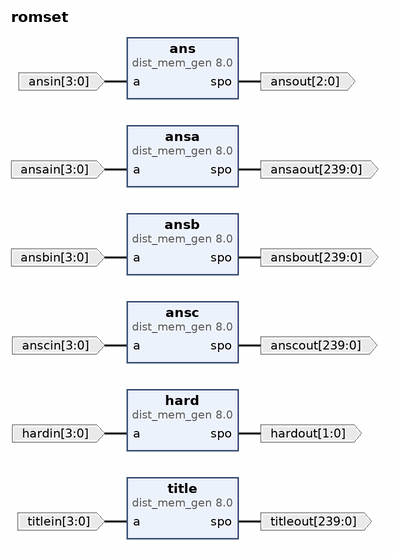
[diagram p0: block diagram of the top level]
# Vivado block design romset, xc7z020clg400-2, Vivado 2018.2
create_bd_design romset

create_bd_port -dir I -from 3 -to 0 ansin
create_bd_port -dir O -from 2 -to 0 ansout
create_bd_port -dir I -from 3 -to 0 ansain
create_bd_port -dir O -from 239 -to 0 ansaout
create_bd_port -dir I -from 3 -to 0 anscin
create_bd_port -dir O -from 239 -to 0 ansbout
create_bd_port -dir I -from 3 -to 0 ansbin
create_bd_port -dir O -from 1 -to 0 hardout
create_bd_port -dir I -from 3 -to 0 titlein
create_bd_port -dir I -from 3 -to 0 hardin
create_bd_port -dir O -from 239 -to 0 anscout
create_bd_port -dir O -from 239 -to 0 titleout

create_bd_cell -type ip -vlnv xilinx.com:ip:dist_mem_gen:8.0 title
set_property -dict [list \
  CONFIG.depth 16 \
  CONFIG.data_width 240 \
  CONFIG.memory_type rom \
  CONFIG.coefficient_file ../../../../xxx/title.coe \
] [get_bd_cells title]
create_bd_cell -type ip -vlnv xilinx.com:ip:dist_mem_gen:8.0 ansa
set_property -dict [list \
  CONFIG.depth 16 \
  CONFIG.data_width 240 \
  CONFIG.memory_type rom \
  CONFIG.coefficient_file ../../../../ansa.coe \
] [get_bd_cells ansa]
create_bd_cell -type ip -vlnv xilinx.com:ip:dist_mem_gen:8.0 ansb
set_property -dict [list \
  CONFIG.depth 16 \
  CONFIG.data_width 240 \
  CONFIG.memory_type rom \
  CONFIG.coefficient_file ../../../../ansb.coe \
] [get_bd_cells ansb]
create_bd_cell -type ip -vlnv xilinx.com:ip:dist_mem_gen:8.0 ansc
set_property -dict [list \
  CONFIG.depth 16 \
  CONFIG.data_width 240 \
  CONFIG.memory_type rom \
  CONFIG.coefficient_file ../../../../ansc.coe \
] [get_bd_cells ansc]
create_bd_cell -type ip -vlnv xilinx.com:ip:dist_mem_gen:8.0 hard
set_property -dict [list \
  CONFIG.depth 16 \
  CONFIG.data_width 2 \
  CONFIG.memory_type rom \
  CONFIG.coefficient_file ../../../../hard.coe \
] [get_bd_cells hard]
create_bd_cell -type ip -vlnv xilinx.com:ip:dist_mem_gen:8.0 ans
set_property -dict [list \
  CONFIG.depth 16 \
  CONFIG.data_width 3 \
  CONFIG.memory_type rom \
  CONFIG.coefficient_file ../../../../ans.coe \
] [get_bd_cells ans]

# ---- connections ----

connect_bd_net -net a_0_1 [get_bd_ports ansin] [get_bd_pins ans/a]
connect_bd_net [get_bd_pins ans/spo] [get_bd_ports ansout]
connect_bd_net -net a_1_1 [get_bd_ports ansain] [get_bd_pins ansa/a]
connect_bd_net [get_bd_pins ansa/spo] [get_bd_ports ansaout]
connect_bd_net -net a_2_1 [get_bd_ports anscin] [get_bd_pins ansc/a]
connect_bd_net [get_bd_pins ansb/spo] [get_bd_ports ansbout]
connect_bd_net -net a_3_1 [get_bd_ports ansbin] [get_bd_pins ansb/a]
connect_bd_net [get_bd_pins hard/spo] [get_bd_ports hardout]
connect_bd_net -net a_4_1 [get_bd_ports titlein] [get_bd_pins title/a]
connect_bd_net -net a_5_1 [get_bd_ports hardin] [get_bd_pins hard/a]
connect_bd_net [get_bd_pins ansc/spo] [get_bd_ports anscout]
connect_bd_net [get_bd_pins title/spo] [get_bd_ports titleout]

validate_bd_design
save_bd_design
